# EAGLE schematic sensor_interface (EAGLE 6.6.0)
DESCRIPTION: microOBD 200 OBD-II Module; HW_REV: 1.4; PCB_REV: C; PCB_SPEC1: Layer Count: 4; PCB_SPEC2: Size: 1.3" x 0.59"; PCB_SPEC3: Finish Thickness: 0.049" - 0.052"; PCB_SPEC4: Copper Weight: 1oz; TITLE: STM1120
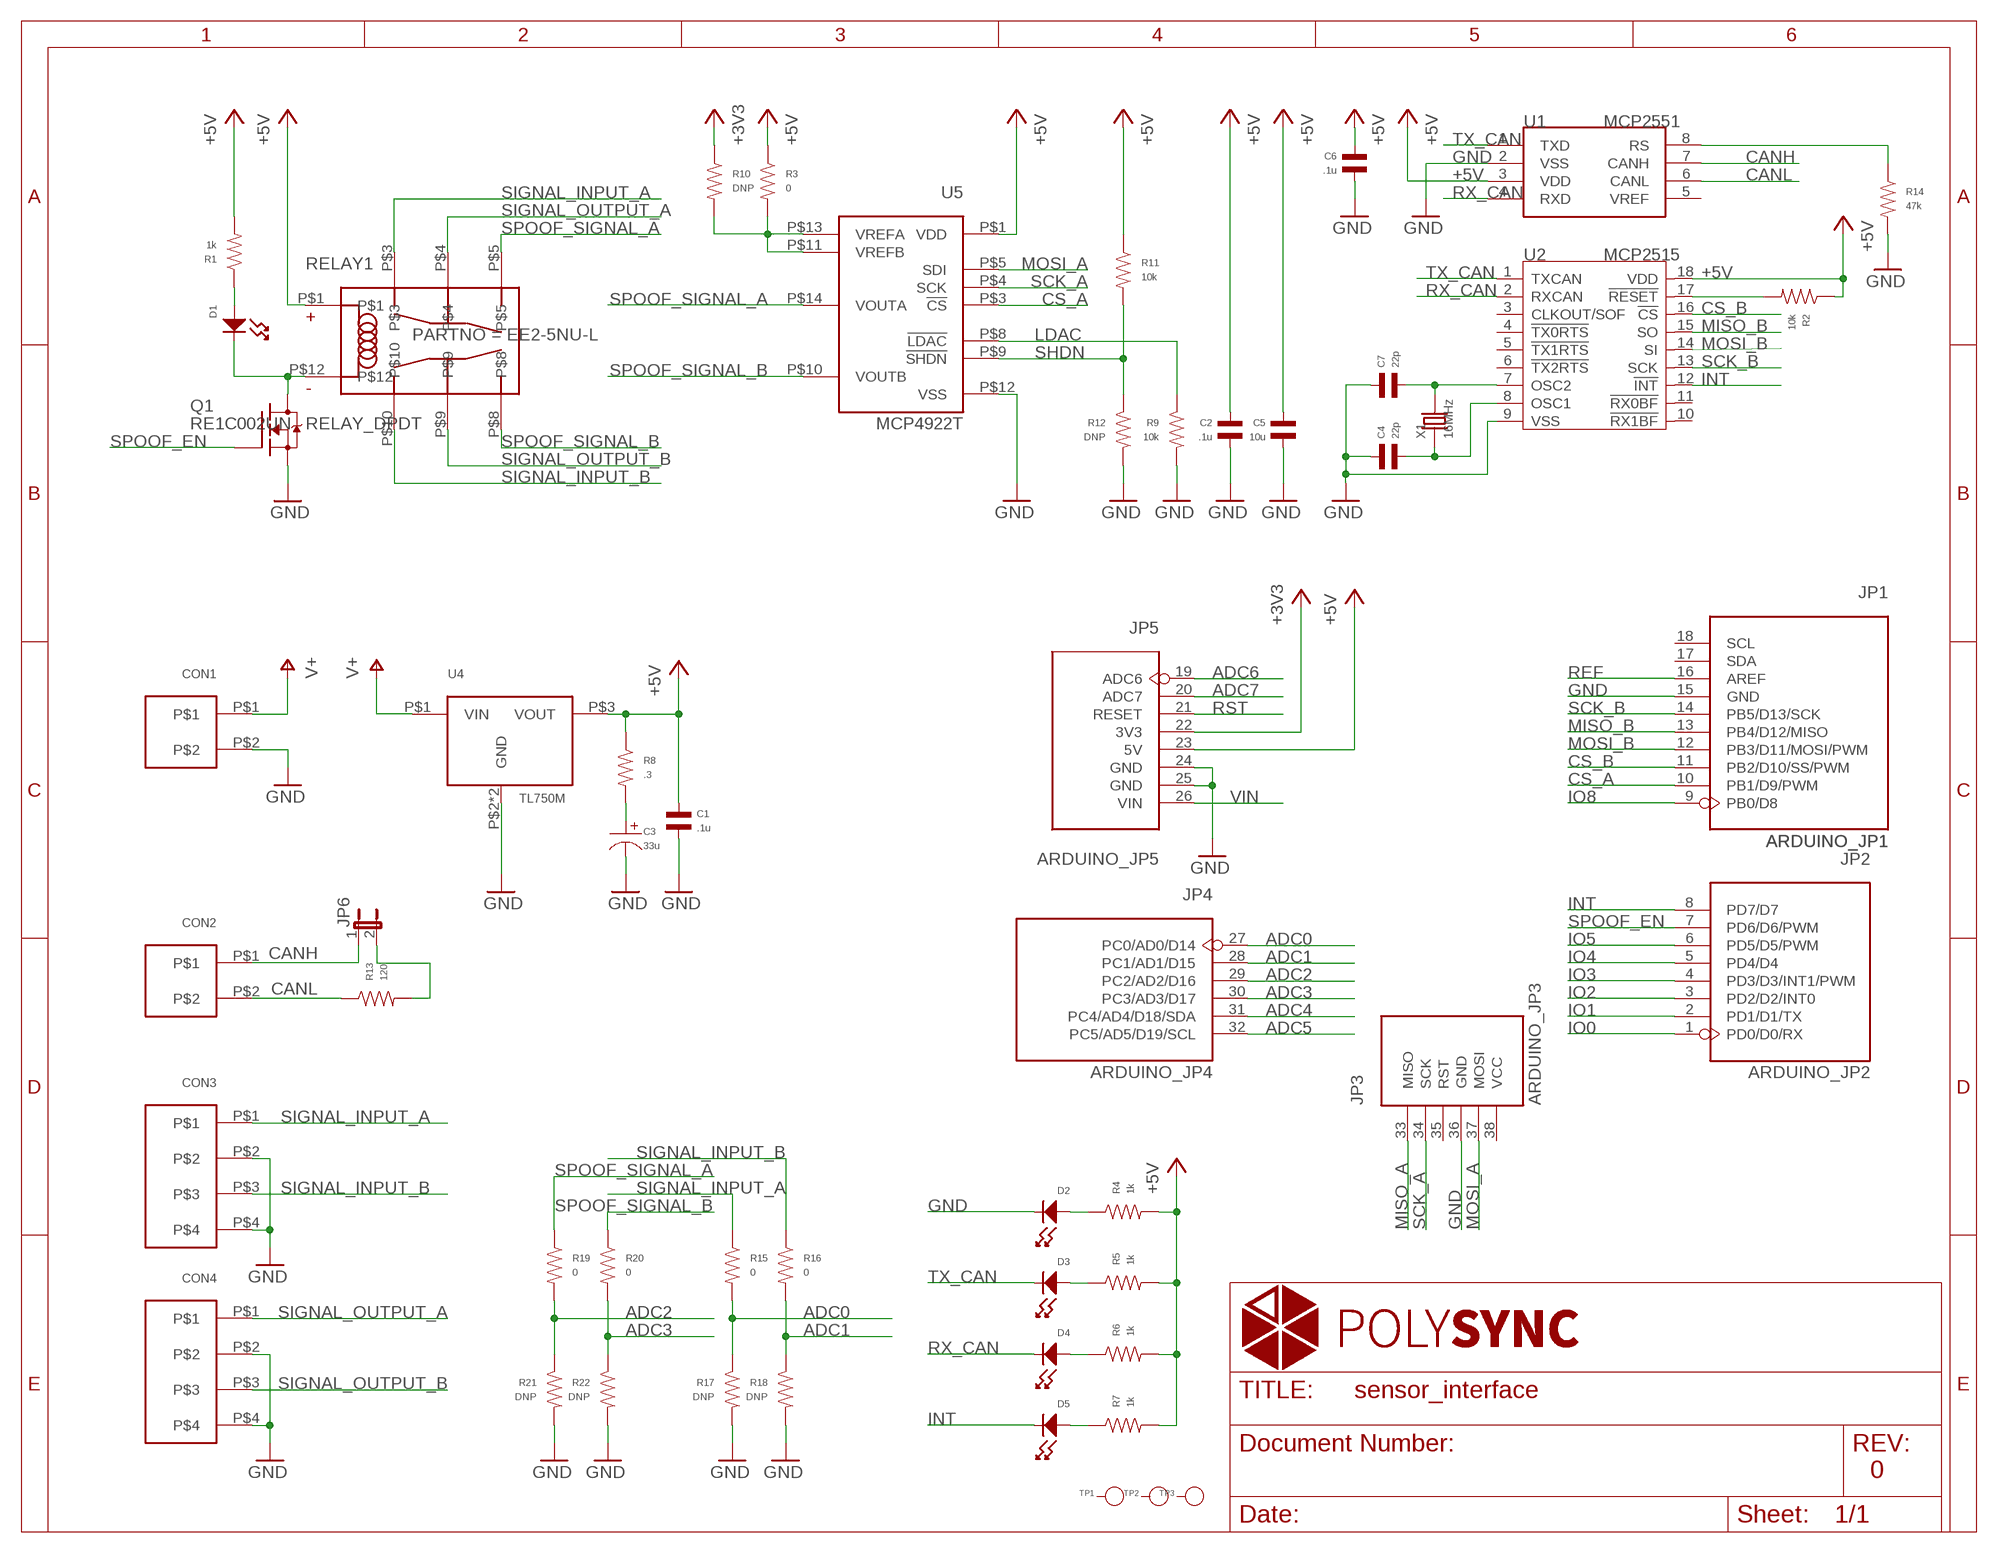
[diagram p0: schematic, sheet 1]

## Parts
C1  .1u  CAPACITOR_NP_0402  [C0402]
C2  .1u  CAPACITOR_NP_0402  [C0402]
C3  33u  CAPACITOR_P  [CP1206]
C4  22p  CAPACITOR_NP_0402  [C0402]
C5  10u  CAPACITOR_NP_0805  [C0805]
C6  .1u  CAPACITOR_NP_0402  [C0402]
C7  22p  CAPACITOR_NP_0402  [C0402]
CON1  CON2  [PHOENIX_2_45]
CON2  CON2  [PHOENIX_2_45]
CON3  CON4  [PHOENIX_4_45]
CON4  CON4  [PHOENIX_4_45]
D1  LED_SINGLE-0603  [LED0603]
D2  LED_SINGLE-0603  [LED0603]
D3  LED_SINGLE-0603  [LED0603]
D4  LED_SINGLE-0603  [LED0603]
D5  LED_SINGLE-0603  [LED0603]
JP1  ARDUINO_JP1  [ARDUINO_JP1]
JP2  ARDUINO_JP2  [ARDUINO_JP2]
JP3  ARDUINO_JP3  [ARDUINO_JP3]
JP4  ARDUINO_JP4  [ARDUINO_JP4]
JP5  ARDUINO_JP5  [ARDUINO_JP5]
JP6  JP1E  [JP1]
Q1  RE1C002UN  [EMT3F]
R1  1k  RESISTOR_0402  [R0402]
R2  10k  RESISTOR_0402  [R0402]
R3  0  RESISTOR_0402  [R0402]
R4  1k  RESISTOR_0402  [R0402]
R5  1k  RESISTOR_0402  [R0402]
R6  1k  RESISTOR_0402  [R0402]
R7  1k  RESISTOR_0402  [R0402]
R8  .3  RESISTOR_0402  [R0402]
R9  10k  RESISTOR_0402  [R0402]
R10  DNP  RESISTOR_0402  [R0402]
R11  10k  RESISTOR_0402  [R0402]
R12  DNP  RESISTOR_0402  [R0402]
R13  120  RESISTOR_0402  [R0402]
R14  47k  RESISTOR_0402  [R0402]
R15  0  RESISTOR_0402  [R0402]
R16  0  RESISTOR_0402  [R0402]
R17  DNP  RESISTOR_0402  [R0402]
R18  DNP  RESISTOR_0402  [R0402]
R19  0  RESISTOR_0402  [R0402]
R20  0  RESISTOR_0402  [R0402]
R21  DNP  RESISTOR_0402  [R0402]
R22  DNP  RESISTOR_0402  [R0402]
RELAY1  RELAY_DPDT  [KEMET_EE2]
TP1  PAD-TEST-POINT'4545'  [TP_4545]
TP2  PAD-TEST-POINT'4545'  [TP_4545]
TP3  PAD-TEST-POINT'4545'  [TP_4545]
U1  MCP2551  MCP2551-SOIC8  [SOIC8-6.0]
U2  MCP2515  MCP2515-SOIC18  [SOIC18]
U4  TL750M  [TO-263]
U5  MCP4922T  [TSSOP-14]
X1  16MHz  CRYSTAL-HC49UP  [HC49UP]

## Nets
+3V3: JP5.22(3V3) R10.P$1
+5V: C1.P$1 C2.P$1 C5.P$1 C6.P$1 JP5.23(5V) R1.P$2 R2.P$1 R3.P$1 R4.P$2 R5.P$2 R6.P$2 R7.P$2 R8.P$1 R11.P$1 RELAY1.P$1 U1.3(VDD) U2.18(VDD) U4.P$3(VOUT) U5.P$1(VDD)
ADC0: JP4.27(PC0/AD0/D14) R15.P$2 R17.P$1
ADC1: JP4.28(PC1/AD1/D15) R16.P$2 R18.P$1
ADC2: JP4.29(PC2/AD2/D16) R19.P$2 R21.P$1
ADC3: JP4.30(PC3/AD3/D17) R20.P$2 R22.P$1
ADC4: JP4.31(PC4/AD4/D18/SDA)
ADC5: JP4.32(PC5/AD5/D19/SCL)
ADC6: JP5.19(ADC6)
ADC7: JP5.20(ADC7)
CANH: CON2.P$1 JP6.1 U1.7(CANH)
CANL: CON2.P$2 R13.P$1 U1.6(CANL)
CS_A: JP1.10(PB1/D9/PWM) U5.P$3(!CS)
CS_B: JP1.11(PB2/D10/SS/PWM) U2.16(!CS)
GND: C1.P$2 C2.P$2 C3.P$2 C4.P$1 C5.P$2 C6.P$2 C7.P$1 CON1.P$2 CON3.P$2 CON3.P$4 CON4.P$2 CON4.P$4 D2.CATHODE JP1.15(GND) JP3.36(GND) JP5.24(GND) JP5.25(GND) Q1.P$2(S) R9.P$2 R12.P$2 R14.P$2 R17.P$2 R18.P$2 R21.P$2 R22.P$2 U1.2(VSS) U2.9(VSS) U4.P$2(GND) U4.P$4(GND) U5.P$12(VSS)
INT: D5.CATHODE JP2.8(PD7/D7) U2.12(!INT)
IO0: JP2.1(PD0/D0/RX)
IO1: JP2.2(PD1/D1/TX)
IO2: JP2.3(PD2/D2/INT0)
IO3: JP2.4(PD3/D3/INT1/PWM)
IO4: JP2.5(PD4/D4)
IO5: JP2.6(PD5/D5/PWM)
IO8: JP1.9(PB0/D8)
LDAC: R9.P$1 U5.P$8(!LDAC)
MISO_A: JP3.33(MISO)
MISO_B: JP1.13(PB4/D12/MISO) U2.15(SO)
MOSI_A: JP3.37(MOSI) U5.P$5(SDI)
MOSI_B: JP1.12(PB3/D11/MOSI/PWM) U2.14(SI)
N$1: D3.ANODE R5.P$1
N$2: JP6.2 R13.P$2
N$3: D1.CATHODE Q1.P$3(D) RELAY1.P$12
N$4: C3.P$1 R8.P$2
N$5: D4.ANODE R6.P$1
N$6: D2.ANODE R4.P$1
N$7: R3.P$2 R10.P$2 U5.P$11(VREFB) U5.P$13(VREFA)
N$8: D5.ANODE R7.P$1
N$9: R14.P$1 U1.8(RS)
N$10: D1.ANODE R1.P$1
N$16: C7.P$2 U2.7(OSC2) X1.2
N$17: C4.P$2 U2.8(OSC1) X1.1
REF: JP1.16(AREF)
RST: JP5.21(RESET)
RST_N: R2.P$2 U2.17(!RESET)
RX_CAN: D4.CATHODE U1.4(RXD) U2.2(RXCAN)
SCK_A: JP3.34(SCK) U5.P$4(SCK)
SCK_B: JP1.14(PB5/D13/SCK) U2.13(SCK)
SHDN: R11.P$2 R12.P$1 U5.P$9(!SHDN)
SIGNAL_INPUT_A: CON3.P$1 R15.P$1 RELAY1.P$3
SIGNAL_INPUT_B: CON3.P$3 R16.P$1 RELAY1.P$10
SIGNAL_OUTPUT_A: CON4.P$1 RELAY1.P$4
SIGNAL_OUTPUT_B: CON4.P$3 RELAY1.P$9
SPOOF_EN: JP2.7(PD6/D6/PWM) Q1.P$1(G)
SPOOF_SIGNAL_A: R19.P$1 RELAY1.P$5 U5.P$14(VOUTA)
SPOOF_SIGNAL_B: R20.P$1 RELAY1.P$8 U5.P$10(VOUTB)
TX_CAN: D3.CATHODE U1.1(TXD) U2.1(TXCAN)
V+: CON1.P$1 U4.P$1(VIN)
VIN: JP5.26(VIN)
Unconnected: JP1.17(SDA) JP1.18(SCL) JP3.35(RST) JP3.38(VCC) TP1.T TP2.T TP3.T U1.5(VREF) U2.3(CLKOUT/SOF) U2.4(!TX0RTS) U2.5(!TX1RTS) U2.6(!TX2RTS) U2.10(!RX1BF) U2.11(!RX0BF)

## Notes on the sheet
- 0

## Library data of the parts
C1 C2 C4-C7 = MF_Passives:CAPACITOR_NP: Library: MF_Passives Description: Device for Non-Polarized Capacitors. Manufacture part number (MPN) can be added via Attributes. Check https://factory.macrofab.com/parts for the house parts list.; POPULATE: 1
C3 = MF_Passives:CAPACITOR_P: Library: MF_Passives Description: Device for Polarized Capacitors. Manufacture part number (MPN), Voltage Rating, and Tolerance can be added via Attributes. Check https://factory.macrofab.com/parts for the house parts list.
CON1 CON2 = polysync:CON2
CON3 CON4 = polysync:CON4
D1-D5 = MF_LEDs:LED_SINGLE: Library: MF_LEDs Description: Device for Single LED Packages. Manufacture part number (MFG#) can be added via Attributes.; HOUSEPART: NO; POPULATE: 1
JP1 = polysync_steering_throttle:ARDUINO_JP1
JP2 = polysync_steering_throttle:ARDUINO_JP2
JP3 = polysync_steering_throttle:ARDUINO_JP3
JP4 = polysync_steering_throttle:ARDUINO_JP4
JP5 = polysync_steering_throttle:ARDUINO_JP5
JP6 = jumper:JP1E: JUMPER
Q1 = BTLE_widget:RE1C002UN
R1-R22 = MF_Passives:RESISTOR: Library: MF_Passives Description: Device for Resistors. Manufacture part number (MPN), Voltage, Tolerance, and Wattage Rating can be added via Attributes. Check https://factory.macrofab.com/parts for the house parts list.; POPULATE: 1
RELAY1 = polysync:RELAY_DPDT; PARTNO: EE2-5NU-L
TP1-TP3 = Discrete:PAD-TEST-POINT; PARTNO: DNP
U1 = IC:MCP2551: High-Speed CAN Transceiver http://ww1.microchip.com/downloads/en/devicedoc/21667f.pdf
U2 = IC:MCP2515: Stand-Alone CAN Controller With SPI Interface
U4 = polysync:TL750M
U5 = polysync:MCP4922T
X1 = Discrete:CRYSTAL*: CRYSTAL

## Net classes
0 default: width 0.152 mm, drill 0.305 mm, clearance 0.152 mm